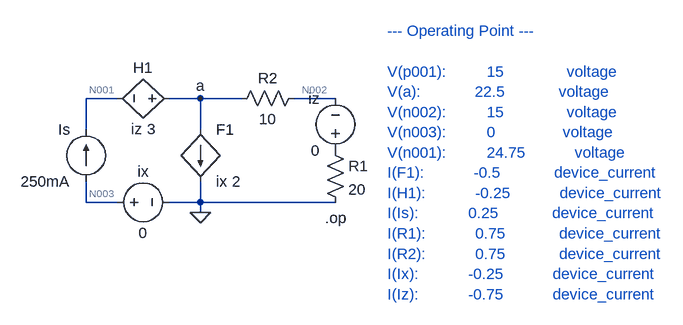
[diagram p0: schematic Draft1.asc]
Draft1.asc, the LTspice schematic file:
Version 4
SHEET 1 880 680
WIRE -16 112 -64 112
WIRE 112 112 64 112
WIRE 176 112 112 112
WIRE 320 112 256 112
WIRE -64 160 -64 112
WIRE 112 160 112 112
WIRE -64 272 -64 240
WIRE -16 272 -64 272
WIRE 112 272 112 240
WIRE 112 272 64 272
WIRE 320 272 112 272
WIRE 112 288 112 272
FLAG 112 288 0
FLAG 112 112 a
SYMBOL res 304 176 R0
SYMATTR InstName R1
SYMATTR Value 20
SYMBOL res 160 128 R270
WINDOW 0 32 56 VTop 2
WINDOW 3 0 56 VBottom 2
SYMATTR InstName R2
SYMATTR Value 10
SYMBOL current -64 240 R180
WINDOW 0 24 80 Left 2
WINDOW 3 24 0 Left 2
SYMATTR InstName Is
SYMATTR Value 250mA
SYMBOL h 80 112 R90
WINDOW 0 -32 56 VBottom 2
WINDOW 3 32 56 VTop 2
SYMATTR InstName H1
SYMATTR Value iz 3
SYMBOL voltage -32 272 R270
WINDOW 0 32 56 VTop 2
WINDOW 3 -32 56 VBottom 2
SYMATTR InstName ix
SYMATTR Value 0
SYMBOL f 112 160 R0
SYMATTR InstName F1
SYMATTR Value ix 2
SYMBOL voltage 320 208 R180
WINDOW 0 24 96 Left 2
WINDOW 3 24 16 Left 2
SYMATTR InstName iz
SYMATTR Value 0
TEXT 304 296 Left 2 !.op
TEXT 400 8 Left 2 ;--- Operating Point ---\n \nV(p001):         15              voltage\nV(a):            22.5            voltage\nV(n002):         15              voltage\nV(n003):         0               voltage\nV(n001):         24.75           voltage\nI(F1):           -0.5            device_current\nI(H1):           -0.25           device_current\nI(Is):           0.25            device_current\nI(R1):           0.75            device_current\nI(R2):           0.75            device_current\nI(Ix):           -0.25           device_current\nI(Iz):           -0.75           device_current

The netlist it stands for:
* Draft1.asc
R1 P001 0 20
R2 a N002 10
Is N003 N001 250mA
H1 a N001 iz 3
V§ix N003 0 0
F1 a 0 ix 2
V§iz P001 N002 0
.op
* --- Operating Point ---
* V(p001):         15              voltage
* V(a):            22.5            voltage
* V(n002):         15              voltage
* V(n003):         0               voltage
* V(n001):         24.75           voltage
* I(F1):           -0.5            device_current
* I(H1):           -0.25           device_current
* I(Is):           0.25            device_current
* I(R1):           0.75            device_current
* I(R2):           0.75            device_current
* I(Ix):           -0.25           device_current
* I(Iz):           -0.75           device_current
.backanno
.end

* Results of the author's LTspice run, read from the files saved beside the schematic
* Operating Point:
*   V(p001) = 15 V
*   V(a) = 22.5 V
*   V(n002) = 15 V
*   V(n003) = 0 V
*   V(n001) = 24.75 V
*   I(F1) = -500 mA
*   I(H1) = -250 mA
*   I(Is) = 250 mA
*   I(R1) = 750 mA
*   I(R2) = 750 mA
*   I(Ix) = -250 mA
*   I(Iz) = -750 mA